# Altium schematic sheet USB_Mini.SchDoc
size A4; Engineer: JBayalas; DocumentNumber: 8; Revision: V1.1; SheetNumber: 8; SheetTotal: 13
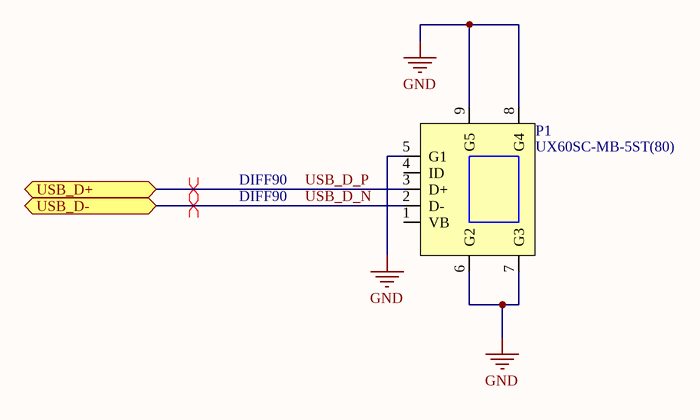
[diagram p0: USB_Mini.SchDoc]

## Parts
P1  *  [UX60SC-MB-5ST(80)]  (value not drawn)

## Ports
USB_D+ (bidir), USB_D- (bidir)

## Nets
GND: P1.5(G1) P1.6(G2) P1.7(G3) P1.8(G4) P1.9(G5)
USB_D_N: P1.2(D-) ; port USB_D-
USB_D_P: P1.3(D+) ; port USB_D+

Not connected (* = marked no-connect by the designer): P1 1(VB) 4(ID)

## Layout directives
differential pair; net class DIFF90: USB_D_N, USB_D_P

## Notes on the sheet
- Title:
- Sheet:
- Date:
- of
- Project:
- Revision:
- Engineer:
- Wi4B S.r.l

## Library data of the parts
P1 = UX60SC-MB-5ST(80): CONN RCPT USB MINI B R/A SMD; MFT: Hirose Electric Co Ltd; VALUE: UX60SC-MB-5ST(80); TYPE: SMD; RATING: *; LOAD: *; MPN: UX60SC-MB-5ST(80); FUNCTION: USB